# Altium schematic sheet Sheet0-mcu.SchDoc
size A4; SheetNumber: 1; SheetTotal: 3
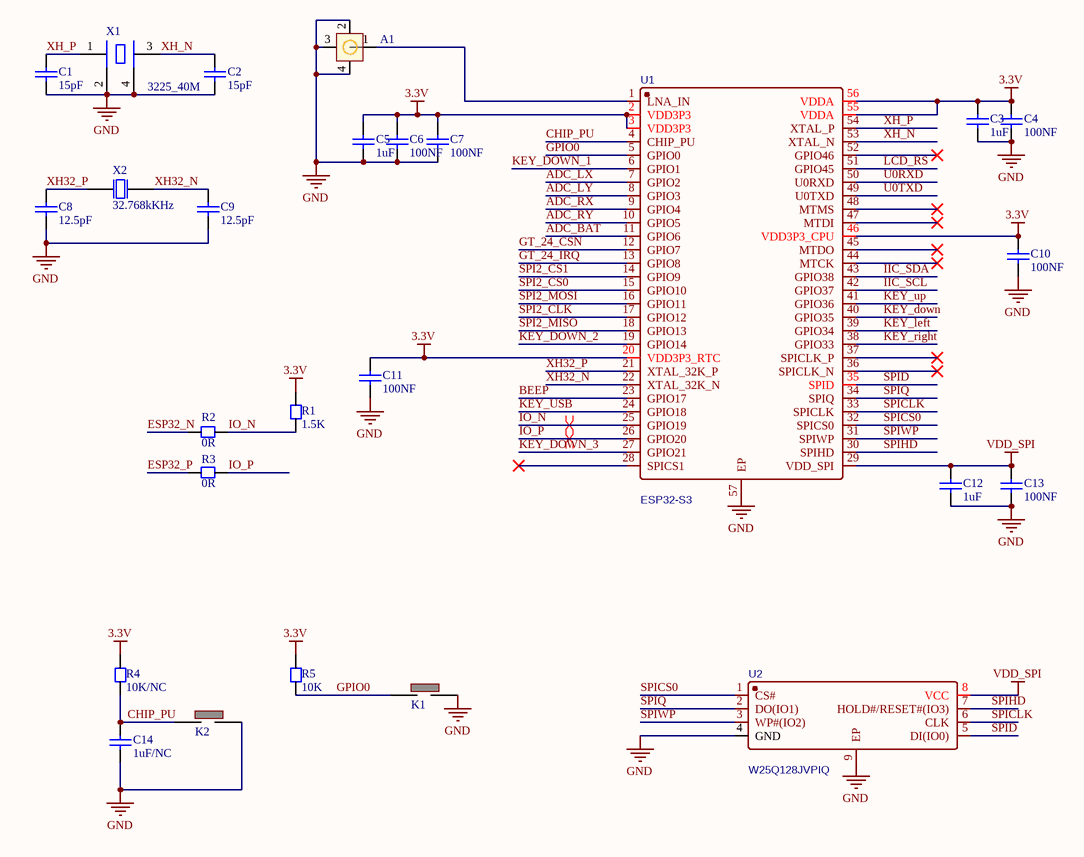
[diagram p0: Sheet0-mcu.SchDoc]

## Parts
A1  ANT-IPEX  [IPEX-SMD_HC-RF-IPEX0303-01]  (value not drawn)
C1  15pF  [CC1608-0603]
C2  15pF  [CC1608-0603]
C3  1uF  [CC1608-0603]
C4  100NF  [CC1608-0603]
C5  1uF  [CC1608-0603]
C6  100NF  [CC1608-0603]
C7  100NF  [CC1608-0603]
C8  12.5pF  [CC1608-0603]
C9  12.5pF  [CC1608-0603]
C10  100NF  [CC1608-0603]
C11  100NF  [CC1608-0603]
C12  1uF  [CC1608-0603]
C13  100NF  [CC1608-0603]
C14  1uF/NC  [CC1608-0603]
K1  KEY 3*4  [KEY 3*4]  (value not drawn)
K2  KEY 3*4  [KEY 3*4]  (value not drawn)
R1  1.5K  [CR1608-0603]
R2  0R  [CR1608-0603]
R3  0R  [CR1608-0603]
R4  10K/NC  [CR1608-0603]
R5  10K  [CR1608-0603]
U1  ESP32-S3  [QFN-56]
U2  W25Q128JVPIQ  [WSON-8]
X1  3225_40M  [XTAL-3225]
X2  32.768kKHz  [XTAL-3215]

## Nets
3.3V: C3.2 C4.2 C5.2 C6.2 C7.2 C10.2 C11.2 R1.1 R4.2 R5.2 U1.2(VDD3P3) U1.3(VDD3P3) U1.20(VDD3P3_RTC) U1.46(VDD3P3_CPU) U1.55(VDDA) U1.56(VDDA)
GND: A1.2 A1.3 A1.4 C1.1 C2.1 C3.1 C4.1 C5.1 C6.1 C7.1 C8.1 C9.1 C10.1 C11.1 C12.1 C13.1 C14.1 K1.2 K2.2 U1.57(EP) U2.4(GND) U2.9(EP) X1.2(GND) X1.4(GND)
VDD_SPI: C12.2 C13.2 U1.29(VDD_SPI) U2.8(VCC)
ADC_BAT: U1.11(GPIO6)
ADC_LX: U1.7(GPIO2)
ADC_LY: U1.8(GPIO3)
ADC_RX: U1.9(GPIO4)
ADC_RY: U1.10(GPIO5)
BEEP: U1.23(GPIO17)
CHIP_PU: C14.2 K2.1 R4.1 U1.4(CHIP_PU)
ESP32_N: R2.2
ESP32_P: R3.2
GPIO0: K1.1 R5.1 U1.5(GPIO0)
GT_24_CSN: U1.12(GPIO7)
GT_24_IRQ: U1.13(GPIO8)
IIC_SCL: U1.42(GPIO37)
IIC_SDA: U1.43(GPIO38)
IO_N: R1.2 R2.1 U1.25(GPIO19)
IO_P: R3.1 U1.26(GPIO20)
KEY_down: U1.40(GPIO35)
KEY_DOWN_1: U1.6(GPIO1)
KEY_DOWN_2: U1.19(GPIO14)
KEY_DOWN_3: U1.27(GPIO21)
KEY_left: U1.39(GPIO34)
KEY_right: U1.38(GPIO33)
KEY_up: U1.41(GPIO36)
KEY_USB: U1.24(GPIO18)
LCD_RS: U1.51(GPIO45)
SPI2_CLK: U1.17(GPIO12)
SPI2_CS0: U1.15(GPIO10)
SPI2_CS1: U1.14(GPIO9)
SPI2_MISO: U1.18(GPIO13)
SPI2_MOSI: U1.16(GPIO11)
SPICLK: U1.33(SPICLK) U2.6(CLK)
SPICS0: U1.32(SPICS0) U2.1(CS#)
SPID: U1.35(SPID) U2.5(DI(IO0))
SPIHD: U1.30(SPIHD) U2.7(HOLD#/RESET#(IO3))
SPIQ: U1.34(SPIQ) U2.2(DO(IO1))
SPIWP: U1.31(SPIWP) U2.3(WP#(IO2))
U0RXD: U1.50(U0RXD)
U0TXD: U1.49(U0TXD)
XH32_N: C9.2 U1.22(XTAL_32K_N) X2.2(OSC2)
XH32_P: C8.2 U1.21(XTAL_32K_P) X2.1(OSC1)
XH_N: C2.2 U1.53(XTAL_N) X1.3(OSC2)
XH_P: C1.2 U1.54(XTAL_P) X1.1(OSC1)
NetA1_1: A1.1 U1.1(LNA_IN)

Not connected (* = marked no-connect by the designer): U1 28(SPICS1)* 36(SPICLK_N)* 37(SPICLK_P)* 44(MTCK)* 45(MTDO)* 47(MTDI)* 48(MTMS)* 52(GPIO46)*

## Layout directives
differential pair: IO_N, IO_P

## Library data of the parts
A1 = ANT-IPEX: 贴片封装的天线 封装类型为IPEX
C1-C14 = Cap Chip 0603: 0603封装的电容; Published: 8-Jun-2000; Revision: July-2002: Re-released for DXP Platform.; Publisher: Altium Limited
K1 K2 = KEY 3*4: 轻触开关按键
R1-R5 = Resistor Chip 0603: 0603封装电阻; Published: 8-Jun-2000; Revision: July-2002: Re-released for DXP Platform.; Publisher: Altium Limited
U1 = ESP32-S3: Manufacturer: ESPRESSIF(乐鑫); Contributor: LCSC; Supplier: LCSC; Supplier Part: C2913192; Manufacturer Part: ESP32-S3; JLCPCB Part Class: Extended Part; spicePre: U; spiceSymbolName: ESP32-S3
U2 = W25Q128JVPIQ: Manufacturer: WINBOND(华邦); Contributor: LCSC; Supplier: LCSC; Supplier Part: C2803379; Manufacturer Part: W25Q128JVPIQ; JLCPCB Part Class: Extended Part; spicePre: U; spiceSymbolName: W25Q128JVPIQ
X1 = XTAL 3225: 3225封装的晶振
X2 = XTAL 3215 32.768kKHz: 3215封装的时钟晶振